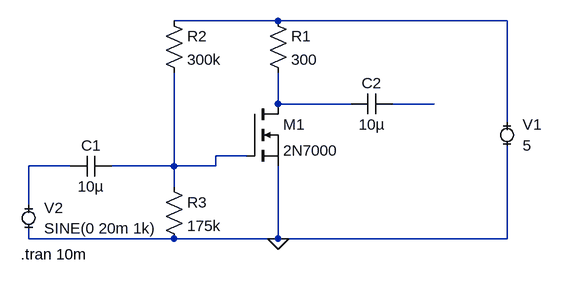
[diagram p0: schematic Підсилювач.asc]
Підсилювач.asc, the LTspice schematic file:
Version 4
SHEET 1 880 680
WIRE 160 0 0 0
WIRE 512 0 160 0
WIRE 160 128 160 80
WIRE 272 128 160 128
WIRE 400 128 336 128
WIRE 512 160 512 0
WIRE 112 208 64 208
WIRE -160 224 -224 224
WIRE 0 224 0 80
WIRE 0 224 -96 224
WIRE 64 224 64 208
WIRE 64 224 0 224
WIRE 0 256 0 224
WIRE -224 288 -224 224
WIRE -224 336 -224 320
WIRE 0 336 -224 336
WIRE 160 336 160 224
WIRE 160 336 0 336
WIRE 512 336 512 192
WIRE 512 336 160 336
FLAG 160 336 0
SYMBOL nmos 112 128 R0
SYMATTR InstName M1
SYMATTR Value 2N7000
SYMBOL res 144 -16 R0
SYMATTR InstName R1
SYMATTR Value 300
SYMBOL res -16 -16 R0
SYMATTR InstName R2
SYMATTR Value 300k
SYMBOL res -16 240 R0
SYMATTR InstName R3
SYMATTR Value 175k
SYMBOL cap -96 208 R90
WINDOW 0 0 32 VBottom 2
WINDOW 3 32 32 VTop 2
SYMATTR InstName C1
SYMATTR Value 10µ
SYMBOL cap 336 112 R90
WINDOW 0 0 32 VBottom 2
WINDOW 3 32 32 VTop 2
SYMATTR InstName C2
SYMATTR Value 10µ
SYMBOL MiniSyms4\\voltage- 512 176 R0
WINDOW 123 0 0 Left 2
WINDOW 39 0 0 Left 2
SYMATTR InstName V1
SYMATTR Value 5
SYMBOL MiniSyms4\\voltage- -224 304 R0
WINDOW 123 0 0 Left 2
WINDOW 39 0 0 Left 2
SYMATTR InstName V2
SYMATTR Value SINE(0 20m 1k)
TEXT -236 360 Left 2 !.tran 10m

The netlist it stands for:
* Підсилювач.asc
M1 N002 N004 0 0 2N7000
R1 N001 N002 300
R2 N001 N004 300k
R3 N004 0 175k
C1 N004 N005 10µ
C2 N003 N002 10µ
V1 N001 0 5
V2 N005 0 SINE(0 20m 1k)
.model NMOS NMOS
.model PMOS PMOS
.lib standard.mos
.tran 10m
.backanno
.end